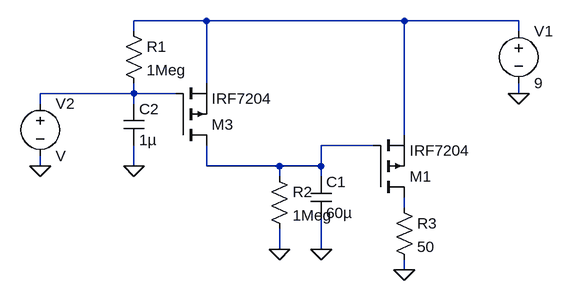
[diagram p0: schematic timer.asc]
timer.asc, the LTspice schematic file:
Version 4
SHEET 1 880 680
WIRE -80 -432 -192 -432
WIRE 224 -432 -80 -432
WIRE 400 -432 224 -432
WIRE -192 -416 -192 -432
WIRE 400 -416 400 -432
WIRE -80 -336 -80 -432
WIRE -192 -320 -192 -336
WIRE -192 -320 -336 -320
WIRE -128 -320 -192 -320
WIRE 400 -320 400 -336
WIRE -336 -304 -336 -320
WIRE -192 -304 -192 -320
WIRE 224 -256 224 -432
WIRE 176 -240 96 -240
WIRE -336 -208 -336 -224
WIRE -192 -208 -192 -240
WIRE -80 -208 -80 -240
WIRE 32 -208 -80 -208
WIRE 96 -208 96 -240
WIRE 96 -208 32 -208
WIRE 32 -192 32 -208
WIRE 96 -192 96 -208
WIRE 224 -144 224 -160
WIRE 32 -80 32 -112
WIRE 96 -80 96 -128
WIRE 224 -48 224 -64
FLAG 400 -320 0
FLAG -336 -208 0
FLAG -192 -208 0
FLAG 32 -80 0
FLAG 96 -80 0
FLAG 224 -48 0
SYMBOL pmos 176 -160 M180
SYMATTR InstName M1
SYMATTR Value IRF7204
SYMBOL res -208 -432 R0
SYMATTR InstName R1
SYMATTR Value 1Meg
SYMBOL voltage 400 -432 R0
WINDOW 123 0 0 Left 2
WINDOW 39 0 0 Left 2
SYMATTR InstName V1
SYMATTR Value 9
SYMBOL voltage -336 -320 R0
SYMATTR InstName V2
SYMBOL pmos -128 -240 M180
SYMATTR InstName M3
SYMATTR Value IRF7204
SYMBOL res 16 -208 R0
SYMATTR InstName R2
SYMATTR Value 1Meg
SYMBOL cap 80 -192 R0
SYMATTR InstName C1
SYMATTR Value 60µ
SYMBOL cap -208 -304 R0
SYMATTR InstName C2
SYMATTR Value 1µ
SYMBOL res 208 -160 R0
SYMATTR InstName R3
SYMATTR Value 50

The netlist it stands for:
* timer.asc
M1 N004 N003 N001 N001 IRF7204
R1 N001 N002 1Meg
V1 N001 0 9
V2 N002 0 V
M3 N003 N002 N001 N001 IRF7204
R2 N003 0 1Meg
C1 N003 0 60µ
C2 N002 0 1µ
R3 N004 0 50
.model NMOS NMOS
.model PMOS PMOS
.lib standard.mos
.backanno
.end